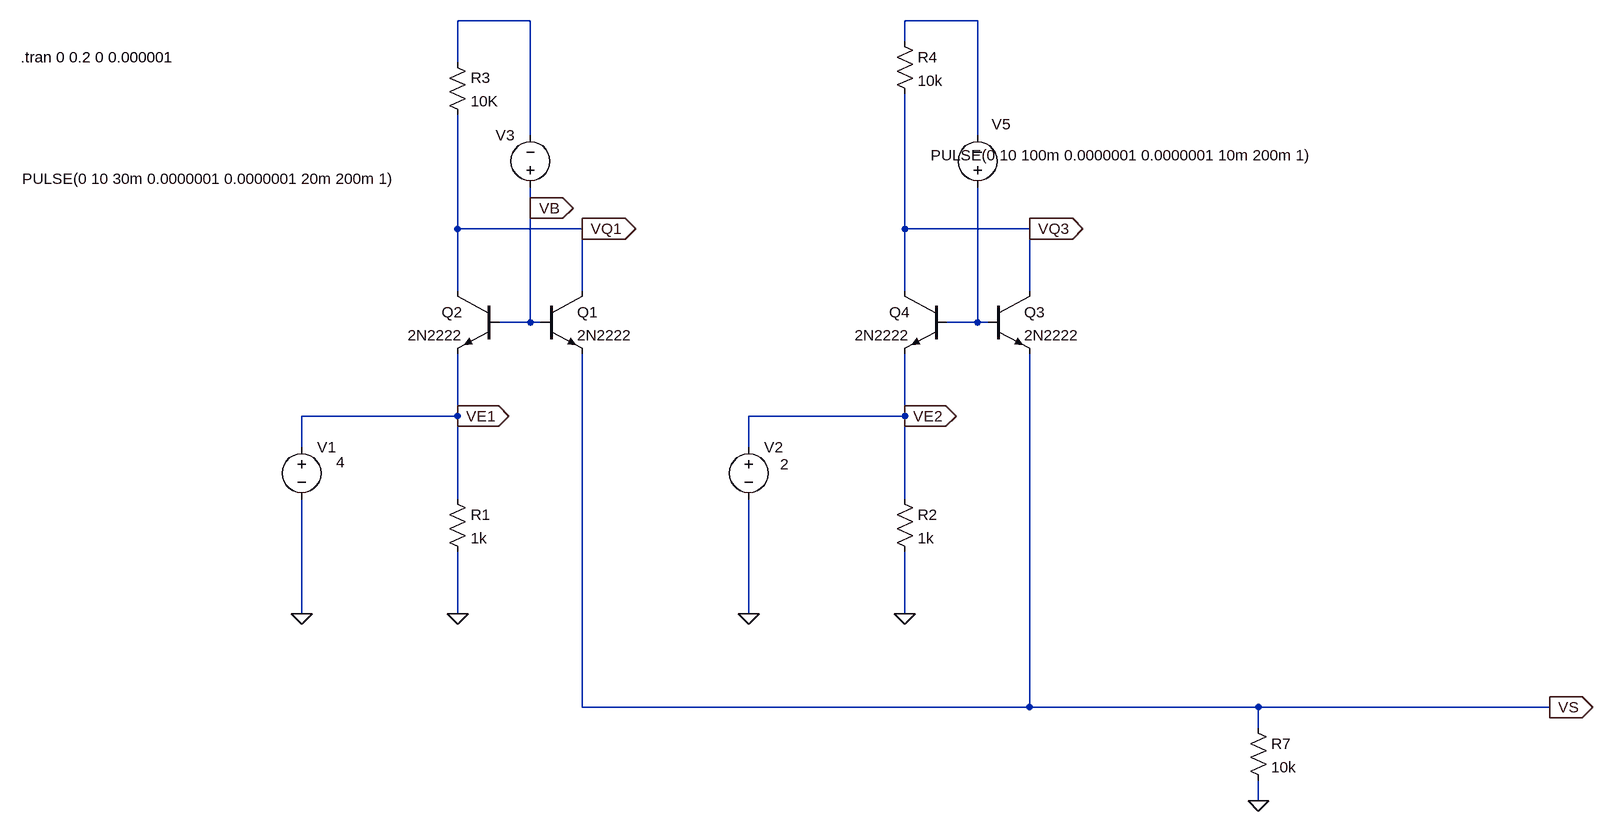
[diagram p0: schematic DFTA255LTSPICE.asc]
DFTA255LTSPICE.asc, the LTspice schematic file:
Version 4
SHEET 1 1704 1072
WIRE 64 -576 -48 -576
WIRE 752 -576 640 -576
WIRE 640 -544 640 -576
WIRE -48 -512 -48 -576
WIRE 64 -400 64 -576
WIRE 752 -400 752 -576
WIRE 64 -288 64 -320
WIRE -48 -256 -48 -432
WIRE 144 -256 -48 -256
WIRE 640 -256 640 -464
WIRE 832 -256 640 -256
WIRE -48 -160 -48 -256
WIRE 144 -160 144 -256
WIRE 640 -160 640 -256
WIRE 832 -160 832 -256
WIRE 64 -112 64 -288
WIRE 64 -112 16 -112
WIRE 80 -112 64 -112
WIRE 752 -112 752 -320
WIRE 752 -112 704 -112
WIRE 768 -112 752 -112
WIRE -48 32 -48 -64
WIRE -48 32 -288 32
WIRE 640 32 640 -64
WIRE 640 32 400 32
WIRE -288 80 -288 32
WIRE 400 80 400 32
WIRE -48 160 -48 32
WIRE 640 160 640 32
WIRE -288 336 -288 160
WIRE -48 336 -48 240
WIRE 400 336 400 160
WIRE 640 336 640 240
WIRE 144 480 144 -64
WIRE 832 480 832 -64
WIRE 832 480 144 480
WIRE 1184 480 832 480
WIRE 1632 480 1184 480
WIRE 1184 512 1184 480
WIRE 1184 624 1184 592
FLAG -288 336 0
FLAG -48 336 0
FLAG -48 32 VE1
IOPIN -48 32 Out
FLAG 400 336 0
FLAG 640 336 0
FLAG 640 32 VE2
IOPIN 640 32 Out
FLAG 144 -256 VQ1
IOPIN 144 -256 Out
FLAG 832 -256 VQ3
IOPIN 832 -256 Out
FLAG 1632 480 VS
IOPIN 1632 480 Out
FLAG 1184 624 0
FLAG 64 -288 VB
IOPIN 64 -288 Out
SYMBOL npn 80 -160 R0
SYMATTR InstName Q1
SYMATTR Value 2N2222
SYMBOL npn 16 -160 M0
SYMATTR InstName Q2
SYMATTR Value 2N2222
SYMBOL voltage -288 64 R0
WINDOW 123 0 0 Left 0
WINDOW 39 0 0 Left 0
WINDOW 3 53 39 Left 2
SYMATTR Value 4
SYMATTR InstName V1
SYMBOL res -64 144 R0
SYMATTR InstName R1
SYMATTR Value 1k
SYMBOL npn 768 -160 R0
SYMATTR InstName Q3
SYMATTR Value 2N2222
SYMBOL npn 704 -160 M0
SYMATTR InstName Q4
SYMATTR Value 2N2222
SYMBOL voltage 400 64 R0
WINDOW 123 0 0 Left 0
WINDOW 39 0 0 Left 0
WINDOW 3 48 42 Left 2
SYMATTR Value 2
SYMATTR InstName V2
SYMBOL res 624 144 R0
SYMATTR InstName R2
SYMATTR Value 1k
SYMBOL voltage 64 -304 R180
WINDOW 0 24 96 Left 2
WINDOW 3 201 29 Left 2
WINDOW 123 0 0 Left 0
WINDOW 39 0 0 Left 0
SYMATTR InstName V3
SYMATTR Value PULSE(0 10 30m 0.0000001 0.0000001 20m 200m 1)
SYMBOL res -64 -528 R0
SYMATTR InstName R3
SYMATTR Value 10K
SYMBOL res 624 -560 R0
SYMATTR InstName R4
SYMATTR Value 10k
SYMBOL res 1168 496 R0
SYMATTR InstName R7
SYMATTR Value 10k
SYMBOL voltage 752 -304 R180
WINDOW 0 -51 113 Left 2
WINDOW 3 -522 65 Left 2
WINDOW 123 0 0 Left 0
WINDOW 39 0 0 Left 0
SYMATTR InstName V5
SYMATTR Value PULSE(0 10 100m 0.0000001 0.0000001 10m 200m 1)
TEXT -720 -520 Left 2 !.tran 0 0.2 0 0.000001

The netlist it stands for:
* DFTA255LTSPICE.asc
Q1 VQ1 VB VS 0 2N2222
Q2 VQ1 VB VE1 0 2N2222
V1 VE1 0 4
R1 VE1 0 1k
Q3 VQ3 N003 VS 0 2N2222
Q4 VQ3 N003 VE2 0 2N2222
V2 VE2 0 2
R2 VE2 0 1k
V3 VB N001 PULSE(0 10 30m 0.0000001 0.0000001 20m 200m 1)
R3 N001 VQ1 10K
R4 N002 VQ3 10k
R7 VS 0 10k
V5 N003 N002 PULSE(0 10 100m 0.0000001 0.0000001 10m 200m 1)
.model NPN NPN
.model PNP PNP
.lib standard.bjt
.tran 0 0.2 0 0.000001
.backanno
.end